# Altium project BSPD_General.PrjPcb
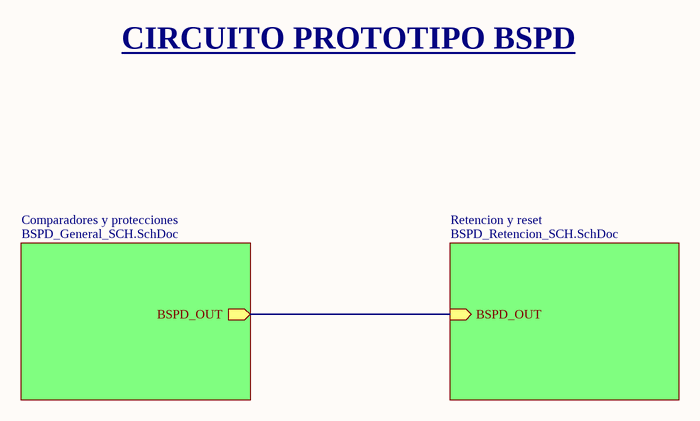
[diagram p0: BSPD_DiagrBloques_SCH.SchDoc]
3 sheets, 68 parts. Net scope: hierarchical (ports join the sheet entries above them; power ports are global).
Board file: BSPD_General_PCB.PcbDoc
Sheets:
  BSPD_DiagrBloques_SCH.SchDoc
    Comparadores y protecciones = BSPD_General_SCH.SchDoc
    Retencion y reset = BSPD_Retencion_SCH.SchDoc

## Sheet BSPD_DiagrBloques_SCH.SchDoc: BSPD - Diagrama en bloques
size A4; Author: FSAE MotorSport UTN; Revision: 1.0; SheetNumber: 1; SheetTotal: 3

### Sub-sheets
Comparadores y protecciones = BSPD_General_SCH.SchDoc: BSPD_OUT (out)
Retencion y reset = BSPD_Retencion_SCH.SchDoc: BSPD_OUT (in)

### Nets
NetJ4_2: sheet Comparadores y protecciones/BSPD_OUT, sheet Retencion y reset/BSPD_OUT

### Notes on the sheet
- CIRCUITO PROTOTIPO BSPD
- Title:
- Size:
- Author:
- A4
- Sheet
- of
- Revision:
- File:
- Date:

## Sheet BSPD_General_SCH.SchDoc: BPSD- Comparadores
size A4; Author: FASE MotorSport UTN; Revision: 1.0; SheetNumber: 2; SheetTotal: 3
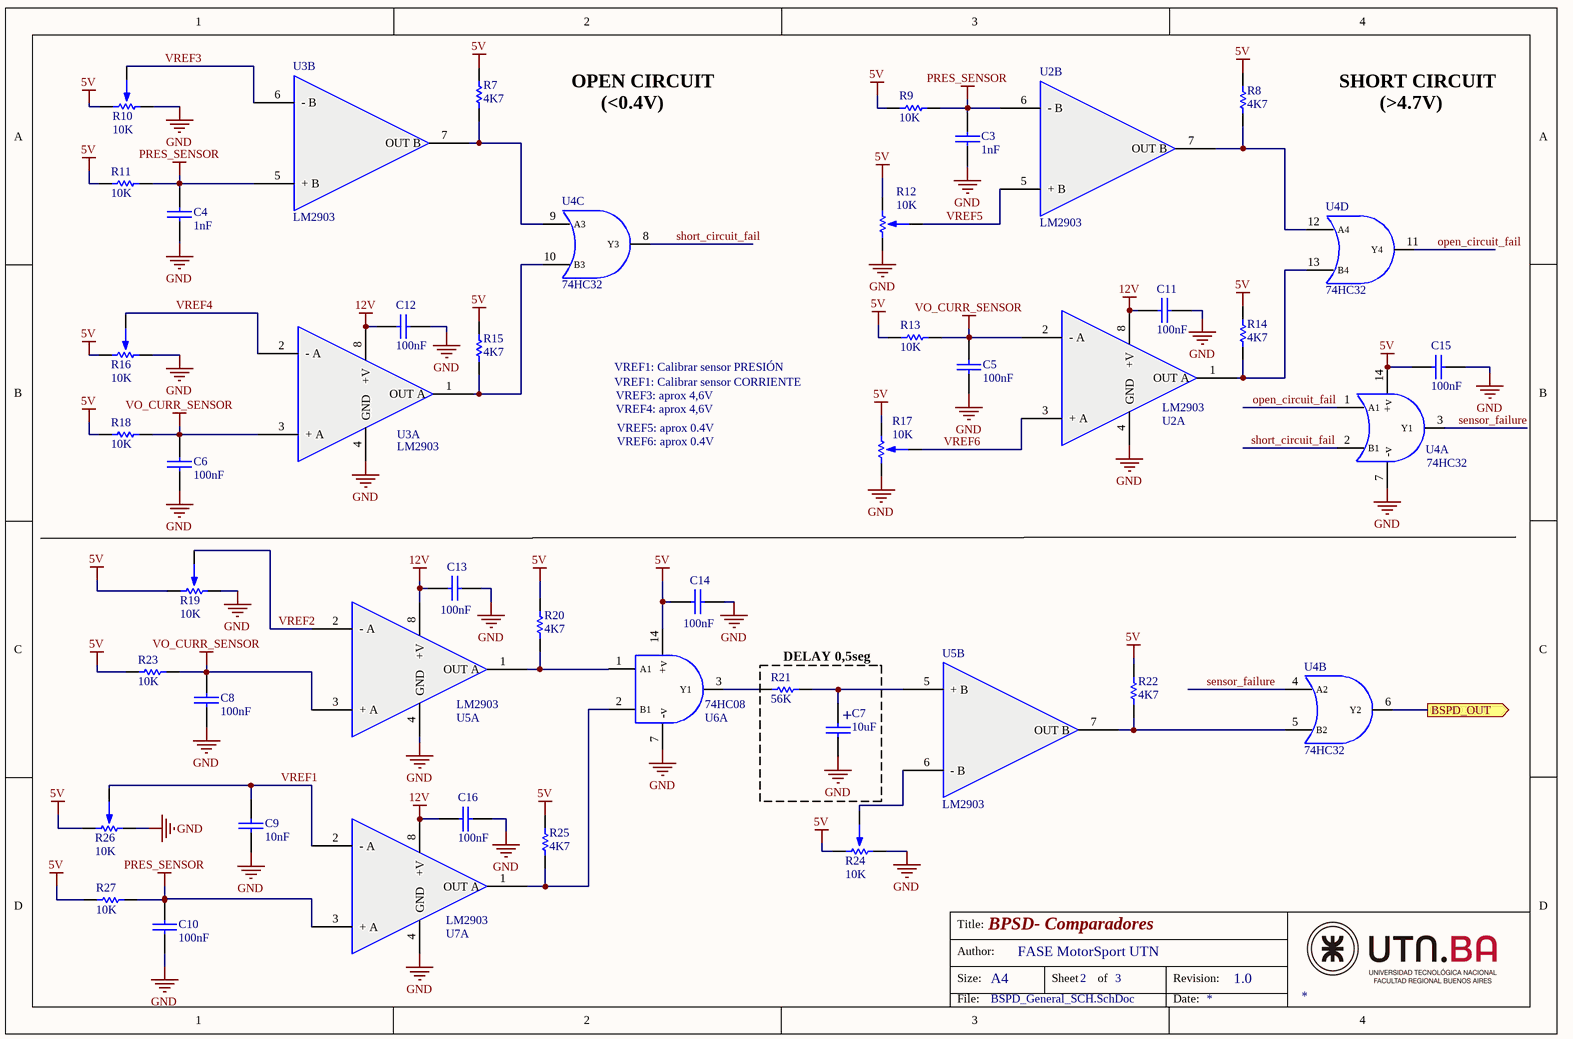
[diagram p1: BSPD_General_SCH.SchDoc]

### Parts
C3  1nF  [CAP200]
C4  1nF  [CAP200]
C5  100nF  [CAP200]
C6  100nF  [CAP200]
C7  10uF  [CAP100RP]
C8  100nF  [CAP200]
C9  10nF  [CAP200]
C10  100nF  [CAP200]
C11  100nF  [CAP200]
C12  100nF  [CAP200]
C13  100nF  [CAP200]
C14  100nF  [CAP200]
C15  100nF  [CAP200]
C16  100nF  [CAP200]
R7  4K7  [RES400]
R8  4K7  [RES400]
R9  10K  [RES400]
R10  10K  [PRESET V]
R11  10K  [RES400]
R12  10K  [PRESET V]
R13  10K  [RES400]
R14  4K7  [RES400]
R15  4K7  [RES400]
R16  10K  [PRESET V]
R17  10K  [PRESET V]
R18  10K  [RES400]
R19  10K  [PRESET V]
R20  4K7  [RES400]
R21  56K  [RES400]
R22  4K7  [RES400]
R23  10K  [RES400]
R24  10K  [PRESET V]
R25  4K7  [RES400]
R26  10K  [PRESET V]
R27  10K  [RES400]
U2  LM2903  [DIP8]  (parts A,B of 2)
U3  LM2903  [DIP8]  (parts A,B of 2)
U4  74HC32  [DIP14]  (parts A,B,C,D of 4)
U5  LM2903  [DIP8]  (parts A,B of 2)
U6  74HC08  [DIP14]  (part A of 4)
U7  LM2903  [DIP8]  (part A of 2)

### Ports
BSPD_OUT (out)

### Nets
5V: C14.1 C15.1 R7.2 R8.2 R9.1 R10.1 R11.1 R12.1 R13.1 R14.2 R15.2 R16.1 R17.1 R18.1 R19.1 R20.2 R22.2 R23.1 R24.1 R25.2 R26.1 R27.1 U4.14(+v) U6.14(+v)
12V: C11.1 C12.1 C13.1 C16.1 U2.8(+V) U3.8(+V) U5.8(+V) U7.8(+V)
GND: C3.2 C4.2 C5.2 C6.2 C7.2 C8.2 C9.2 C10.2 C11.2 C12.2 C13.2 C14.2 C15.2 C16.2 R10.3 R12.3 R16.3 R17.3 R19.3 R24.3 R26.3 U2.4(GND) U3.4(GND) U4.7(-v) U5.4(GND) U6.7(-v) U7.4(GND)
PRES_SENSOR: C3.1 C4.1 C10.1 R9.2 R11.2 R27.2 U2.6(-_B) U3.5(+_B) U7.3(+_A)
VO_CURR_SENSOR: C5.1 C6.1 C8.1 R13.2 R18.2 R23.2 U2.2(-_A) U3.3(+_A) U5.3(+_A)
open_circuit_fail: U4.1(A1) U4.11(Y4)
sensor_failure: U4.3(Y1) U4.4(A2)
short_circuit_fail: U4.2(B1) U4.8(Y3)
VREF1: C9.1 R26.2 U7.2(-_A)
VREF2: R19.2 U5.2(-_A)
VREF3: R10.2 U3.6(-_B)
VREF4: R16.2 U3.2(-_A)
VREF5: R12.2 U2.5(+_B)
VREF6: R17.2 U2.3(+_A)
NetC7_1: C7.1 R21.2 U5.5(+_B)
NetJ4_2: U4.6(Y2) ; port BSPD_OUT
NetR7_1: R7.1 U3.7(OUT_B) U4.9(A3)
NetR8_1: R8.1 U2.7(OUT_B) U4.12(A4)
NetR14_1: R14.1 U2.1(OUT_A) U4.13(B4)
NetR15_1: R15.1 U3.1(OUT_A) U4.10(B3)
NetR20_1: R20.1 U5.1(OUT_A) U6.1(A1)
NetR21_1: R21.1 U6.3(Y1)
NetR22_1: R22.1 U4.5(B2) U5.7(OUT_B)
NetR24_2: R24.2 U5.6(-_B)
NetR25_1: R25.1 U6.2(B1) U7.1(OUT_A)

### Notes on the sheet
- OPEN CIRCUIT
- (<0.4V)
- SHORT CIRCUIT
- (>4.7V)
- VREF1: Calibrar sensor PRESIÓN
- VREF1: Calibrar sensor CORRIENTE
- VREF3: aprox 4,6V
- VREF4: aprox 4,6V
- VREF5: aprox 0.4V
- VREF6: aprox 0.4V
- (near R21) DELAY 0,5seg
- Title:
- Size:
- Author:
- A4
- Sheet
- of
- Revision:
- File:
- Date:
- (in symbol CAPPOL) +

### Library data of the parts
C3-C6 C8-C16 = CAP
C7 = CAPPOL
R7-R9 R11 R13-R15 R18 R20-R23 R25 R27 = RES
R10 R12 R16 R17 R19 R24 R26 = PRESET
U2 U3 U5 U7 = LM2903: Comparador
U4 = 74HC32: Compuerta OR; Autor: SALERNO, Santiago; fecha: 10/05/2019; datasheet: https://cdn.datasheetspdf.com/pdf-down/7/4/H/74HC14-ONSemiconductor.pdf
U6 = 74HC08: Compuerta AND; Autor: SALERNO, Santiago; fecha: 10/05/2019; datasheet: https://cdn.datasheetspdf.com/pdf-down/7/4/H/74HC14-ONSemiconductor.pdf

## Sheet BSPD_Retencion_SCH.SchDoc: BPSD - Retencion estado
size A4; Author: FSAE MotorSport UTN; Organization: UTN; Revision: 1.0; SheetNumber: 3; SheetTotal: 3
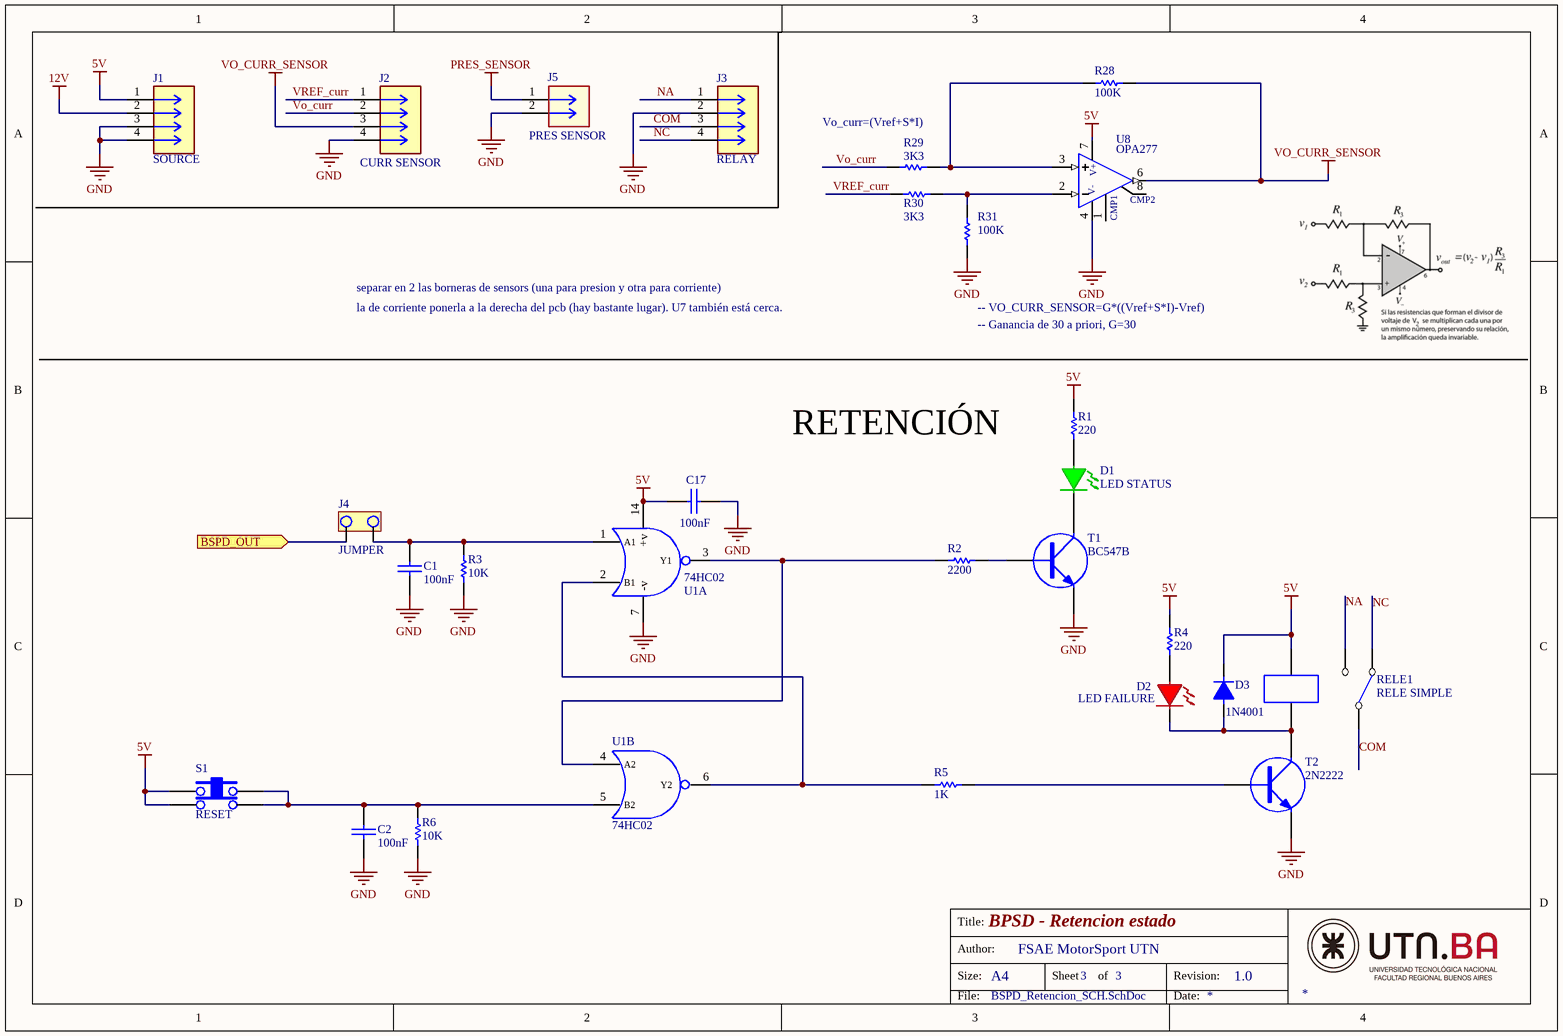
[diagram p2: BSPD_Retencion_SCH.SchDoc]

### Parts
C1  100nF  [CAP200]
C2  100nF  [CAP200]
C17  100nF  [CAP200]
D1  LED STATUS  [LED 3 - Green]
D2  LED FAILURE  [LED 3 - Red]
D3  1N4001  [DO41]
J1  SOURCE  [CONN_SD-44067-001_04_MOL]
J2  CURR SENSOR  [CONN_SD-44067-001_04_MOL]
J3  RELAY  [CONN_SD-44067-001_04_MOL]
J4  JUMPER  [JUMPER2]
J5  PRES SENSOR  [CONN_SD-44067-001_02_MOL]
R1  220  [RES400]
R2  2200  [RES400]
R3  10K  [RES400]
R4  220  [RES400]
R5  1K  [RES400]
R6  10K  [RES400]
R28  100K  [RES400]
R29  3K3  [RES400]
R30  3K3  [RES400]
R31  100K  [RES400]
RELE1  RELE SIMPLE  [RELE SERIE 943]
S1  RESET  [TACTSWITCH]
T1  BC547B  [TO92]
T2  2N2222  [TO-18]
U1  74HC02  [DIP14]  (parts A,B of 4)
U8  OPA277  [DIP8]

### Ports
BSPD_OUT (in)

### Nets
5V: C17.1 D3.2 J1.1 R1.2 R4.2 RELE1.B1 S1.1 S1.2 U1.14(+v) U8.7(V+)
12V: J1.2
GND: C1.2 C2.2 C17.2 J1.3 J1.4 J2.4 J3.2 J5.2 R3.1 R6.1 R31.2 T1.3(E) T2.3(E) U1.7(-v) U8.4(V-)
PRES_SENSOR: J5.1
VO_CURR_SENSOR: J2.3 R28.1 U8.6(OUT)
COM: J3.3 RELE1.C1
NA: J3.1 RELE1.NA1
NC: J3.4 RELE1.NC1
Vo_curr: J2.2 R29.2
VREF_curr: J2.1 R30.2
NetC1_1: C1.1 J4.1 R3.2 U1.1(A1)
NetC2_1: C2.1 R6.2 S1.3 S1.4 U1.5(B2)
NetD1_1: D1.1 R1.1
NetD1_2: D1.2 T1.2(C)
NetD2_1: D2.1 R4.1
NetD2_2: D2.2 D3.1 RELE1.B2 T2.2(C)
NetJ4_2: J4.2 ; port BSPD_OUT
NetR2_1: R2.1 U1.3(Y1) U1.4(A2)
NetR2_2: R2.2 T1.1(B)
NetR5_1: R5.1 U1.2(B1) U1.6(Y2)
NetR5_2: R5.2 T2.1(B)
NetR28_2: R28.2 R29.1 U8.3(+IN)
NetR30_1: R30.1 R31.1 U8.2(-IN)

Not connected (* = marked no-connect by the designer): U8 1(CMP1) 8(CMP2)

### Notes on the sheet
- (near R29) Vo_curr=(Vref+S*I)
- separar en 2 las borneras de sensors (una para presion y otra para corriente)
- la de corriente ponerla a la derecha del pcb (hay bastante lugar). U7 también está cerca.
- -- VO_CURR_SENSOR=G*((Vref+S*I)-Vref)
- -- Ganancia de 30 a priori, G=30
- RETENCIÓN
- Title:
- Size:
- Author:
- A4
- Sheet
- of
- Revision:
- File:
- Date:

### Library data of the parts
C1 C2 C17 = CAP
D1 = LED VERDE
D2 = LED ROJO
D3 = 1N4001: Diodo
J1-J3 = MolexMini 4: Molex mini 50 de 4 pines (440670401); MP: 347920040; Package: None; Price: None; Value: *; Availability: Unavailable
J5 = MolexMini 2: Micro-Fit 3.0 Wire-to-Board Header, Dual Row, Vertical for up to 3.56mm Thick PCB, 2 Circuits, Tin (Sn) Plating; Manufacturer_Name: Molex Connector Corporation; Manufacturer_Part_Number: 440670201; Copyright: Copyright (C) 2025 Ultra Librarian. All rights reserved.; RefDes: RefDes; Type: Type
R1-R6 R28-R31 = RES
S1 = TACT SWITCH
T1 T2 = TRANSISTOR NPN
U1 = 74HC02: Compuerta NOR; Autor: SALERNO, Santiago; fecha: 10/05/2019; datasheet: https://cdn.datasheetspdf.com/pdf-down/7/4/H/74HC14-ONSemiconductor.pdf
U8 = OPA277: / Op Amp Single Low Offset Voltage Amplifier Â±18V 8-Pin PDIP Tube /; MF: Texas Instruments; SnapEDA_Link: https://www.snapeda.com/parts/OPA277/Texas+Instruments/view-part/?ref=snap; Package: None; MP: OPA277; Check_prices: https://www.snapeda.com/parts/OPA277/Texas+Instruments/view-part/?ref=eda; Value: *

## Nets that join several sheets
5V: BSPD_General_SCH (24 pins), BSPD_Retencion_SCH (10 pins)
12V: BSPD_General_SCH (8 pins), BSPD_Retencion_SCH (J1.2)
GND: BSPD_General_SCH (27 pins), BSPD_Retencion_SCH (15 pins)
PRES_SENSOR: BSPD_General_SCH (9 pins), BSPD_Retencion_SCH (J5.1)
VO_CURR_SENSOR: BSPD_General_SCH (9 pins), BSPD_Retencion_SCH (J2.3 R28.1 U8.6)
NetJ4_2: BSPD_General_SCH (U4.6), BSPD_Retencion_SCH (J4.2)